# Altium schematic sheet MCU.SchDoc: Controller
size A4; ApprovedBy: Self; CheckedBy: Self; CompanyName: TAISAT; DrawnBy: Alperen FENERCİ; Organization: IKA; SheetNumber: 4; SheetTotal: 6
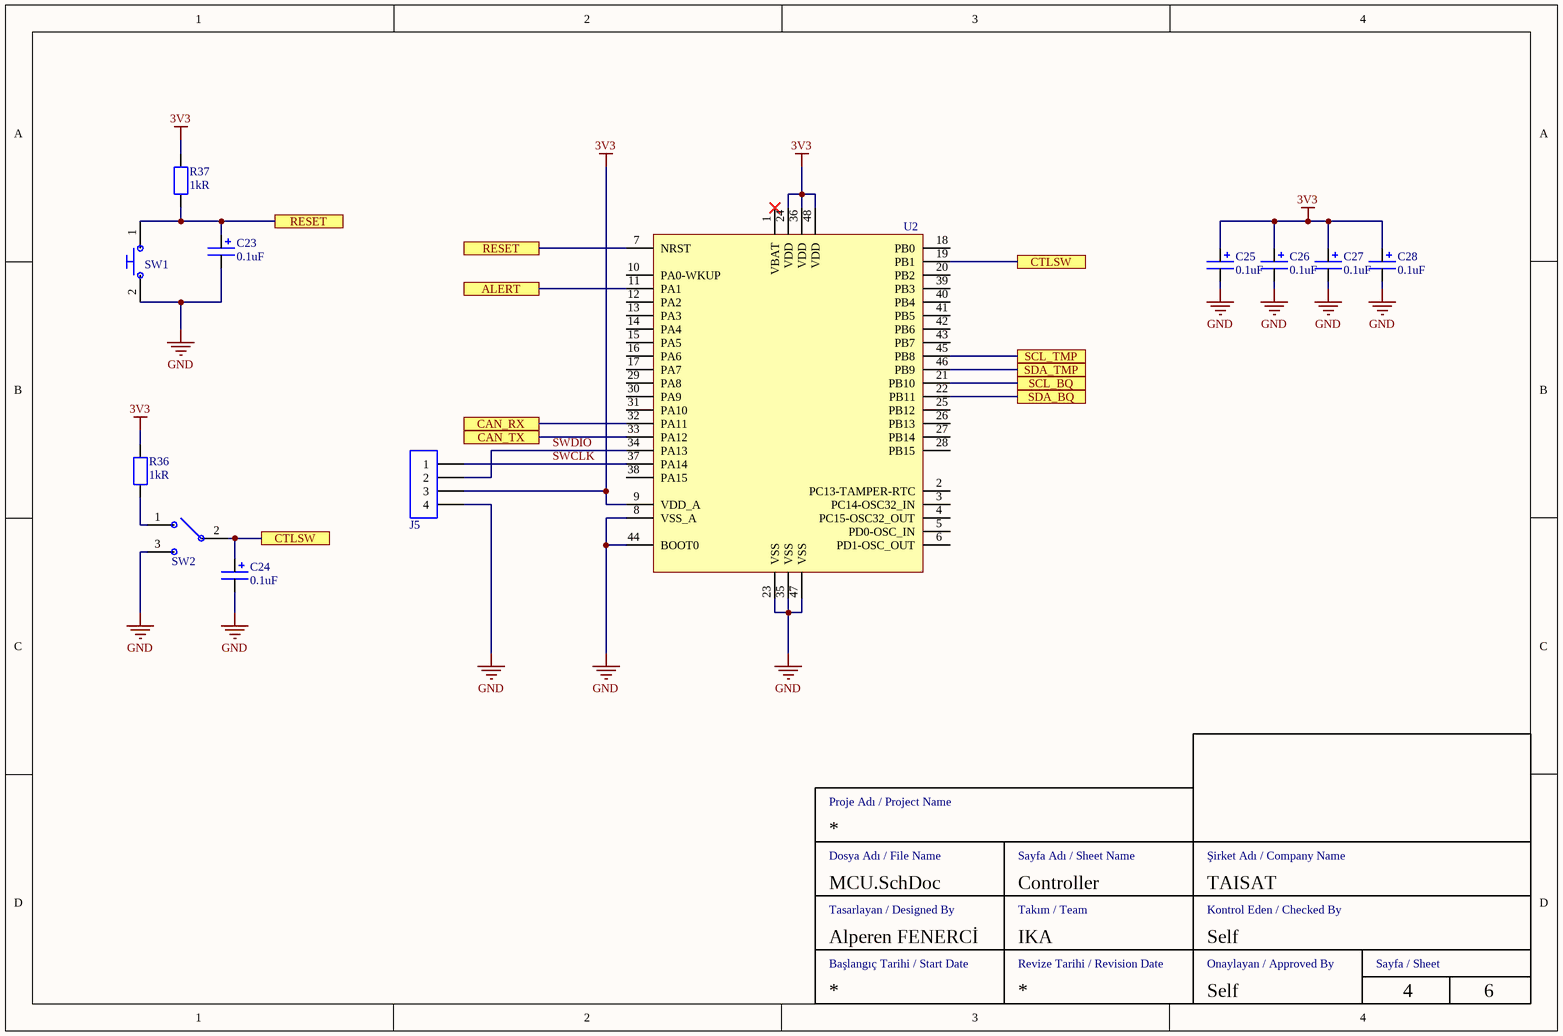
[diagram p0: MCU.SchDoc]

## Parts
C23  value 0.1uF  [CAP 0603]  (hidden comment: CAP 0603)
C24  value 0.1uF  [CAP 0603]  (hidden comment: CAP 0603)
C25  value 0.1uF  [CAP 0603]  (hidden comment: CAP 0603)
C26  value 0.1uF  [CAP 0603]  (hidden comment: CAP 0603)
C27  value 0.1uF  [CAP 0603]  (hidden comment: CAP 0603)
C28  value 0.1uF  [CAP 0603]  (hidden comment: CAP 0603)
J5  146285-4  [HMATHT00C41]  (value not drawn)
R36  value 1kR  [RESISTOR 0603]  (hidden comment: RES 0603)
R37  value 1kR  [RESISTOR 0603]  (hidden comment: RES 0603)
SW1  DTSML-31R  [DTSML]  (value not drawn)
SW2  L-KLS7-SS-12F20A  [SPDT]  (value not drawn)
U2  STM32F103x8  [LQFP48]  (value not drawn)

## Ports
ALERT, CAN_RX, CAN_TX, CTLSW, RESET, SCL_BQ, SCL_TMP, SDA_BQ, SDA_TMP

## Nets
3V3: C25.1 C26.1 C27.1 C28.1 J5.3 R36.2 R37.2 U2.9(VDD_A) U2.24(VDD) U2.36(VDD) U2.48(VDD)
GND: C23.2 C24.2 C25.2 C26.2 C27.2 C28.2 J5.4 SW1.2 SW2.3 U2.8(VSS_A) U2.23(VSS) U2.35(VSS) U2.44(BOOT0) U2.47(VSS)
ALERT: U2.11(PA1) ; port ALERT
CAN_RX: U2.32(PA11) ; port CAN_RX
CAN_TX: U2.33(PA12) ; port CAN_TX
CTLSW: C24.1 SW2.2 U2.19(PB1) ; port CTLSW
RESET: C23.1 R37.1 SW1.1 U2.7(NRST) ; port RESET
SCL_BQ: U2.21(PB10) ; port SCL_BQ
SCL_TMP: U2.45(PB8) ; port SCL_TMP
SDA_BQ: U2.22(PB11) ; port SDA_BQ
SDA_TMP: U2.46(PB9) ; port SDA_TMP
SWCLK: J5.1 U2.37(PA14)
SWDIO: J5.2 U2.34(PA13)
NetR36_1: R36.1 SW2.1

Not connected (* = marked no-connect by the designer): U2 1(VBAT)* 2(PC13-TAMPER-RTC) 3(PC14-OSC32_IN) 4(PC15-OSC32_OUT) 5(PD0-OSC_IN) 6(PD1-OSC_OUT) 10(PA0-WKUP) 12(PA2) 13(PA3) 14(PA4) 15(PA5) 16(PA6) 17(PA7) 18(PB0) 20(PB2) 25(PB12) 26(PB13) 27(PB14) 28(PB15) 29(PA8) 30(PA9) 31(PA10) 38(PA15) 39(PB3) 40(PB4) 41(PB5) 42(PB6) 43(PB7)

## Notes on the sheet
- Dosya Adı / File Name
- Proje Adı / Project Name
- Sayfa Adı / Sheet Name
- Şirket Adı / Company Name
- Tasarlayan / Designed By
- Takım / Team
- Kontrol Eden / Checked By
- Başlangıç Tarihi / Start Date
- Revize Tarihi / Revision Date
- Onaylayan / Approved By
- Sayfa / Sheet

## Library data of the parts
C23-C28 = CAP 0603: Multilayer Ceramic Capacitor; Capacitor Type: MLCC; Case/Package: 0603
J5 = HMATHT00C41: Header for PCB
R36 R37 = RES 0603: SMD Chip Resistor; Case/Package: 0603
SW1 = DTSML-31R: Switch; ComponentLink1Description: Datasheet; ComponentLink1URL: https://cdn.ozdisan.com/ETicaret_Dosya/485632_396522.pdf
SW2 = L-KLS7-SS-12F20A: Switch
U2 = STM32F103x8: STM32 ARM Cortex M3; Case/Package: LQFP; Pins: 48; Category: MCU